# EAGLE design connector-2channel (EAGLE 6.1)
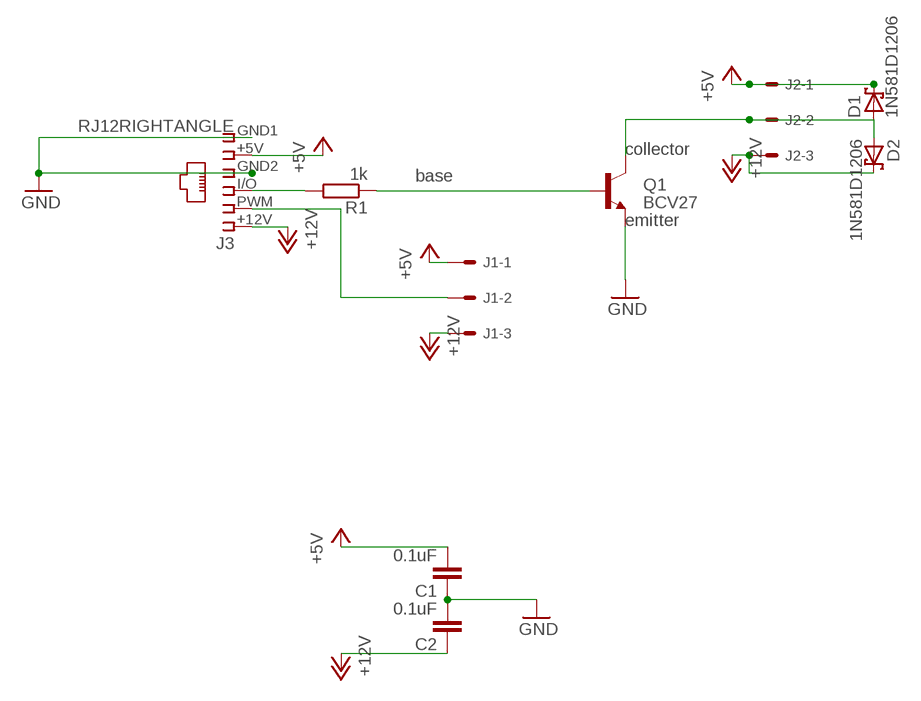
[diagram p0: schematic, sheet 1]

## Parts
C1  0.1uF  C-EUC1206  [C1206]
C2  0.1uF  C-EUC1206  [C1206]
D1  1N581D1206  [LED-1206]
D2  1N581D1206  [LED-1206]
J1  22-27-2031-03  [6410-03]
J2  22-27-2031-03  [6410-03]
J3  RJ12RIGHTANGLE  [RJ12-RIGHTANGLE]
Q1  BCV27  TRANSISTOR_NPNSOT23  [SOT23]
R1  1k  R-EU_M1206  [M1206]

## Nets
+5V: C1.2 D1.C J1.1 J2.1 J3.+5V
+12V: C2.1 D2.C J1.3 J2.3 J3.+12V
GND [power]: C1.1 C2.2 J3.GND1 J3.GND2 Q1.2(E)
N$1: Q1.1(B) R1.1
N$2: J3.I/O R1.2
N$3: J1.2 J3.PWM
N$4: D1.A D2.A J2.2 Q1.3(C)

## Notes on the sheet
- collector
- base
- emitter

## Library data of the parts
C1 C2 = resistor:C-EU: CAPACITOR, European symbol
D1 D2 = lpatiny:1N581*: 1.0A SCHOTTKY BARRIER RECTIFIER Source: http://www.diodes.com/datasheets/ds23001.pdf
J1 J2 = con-molex:22-?-03: CONNECTOR wire to board 2.54 mm (.1 inch) pitch header; OC_FARNELL: unknown; OC_NEWARK: unknown
J3 = lpatiny:RJ12: CORCOM Modular RJ Jacks No Shield Source: www.tycoelectronics.com .. ENG_DS_1654001_1099_RJ_L_0507.pdf
Q1 = SparkFun:TRANSISTOR_NPN: Transistor NPN BJT configuration in SOT23 package. MMBT2222 is the common NPN we use. Double check BCE configuration again layout.
R1 = resistor:R-EU_: RESISTOR, European symbol

## Net classes
0 default: width 0.457 mm
1 power: width 0.457 mm
2 highpower: width 0.457 mm
3 fine: width 0.305 mm

## Board
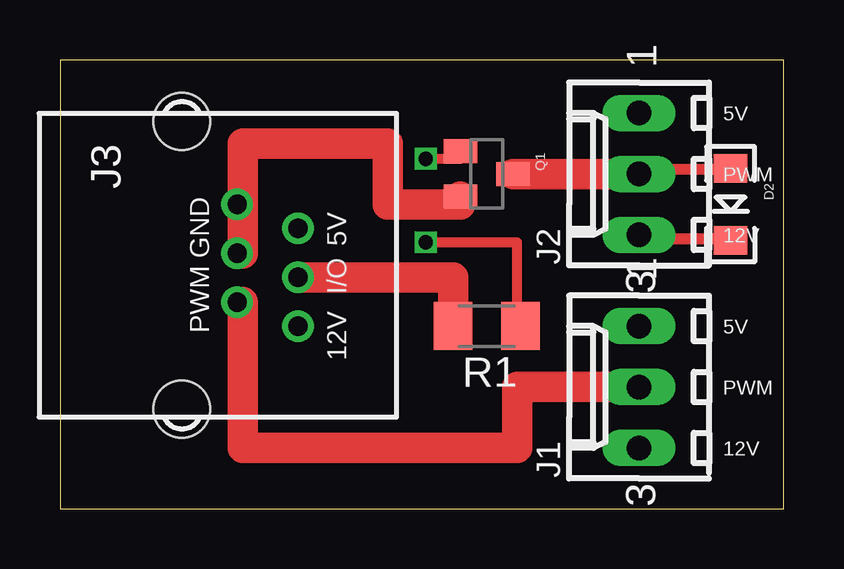
[diagram p1: board, top side]
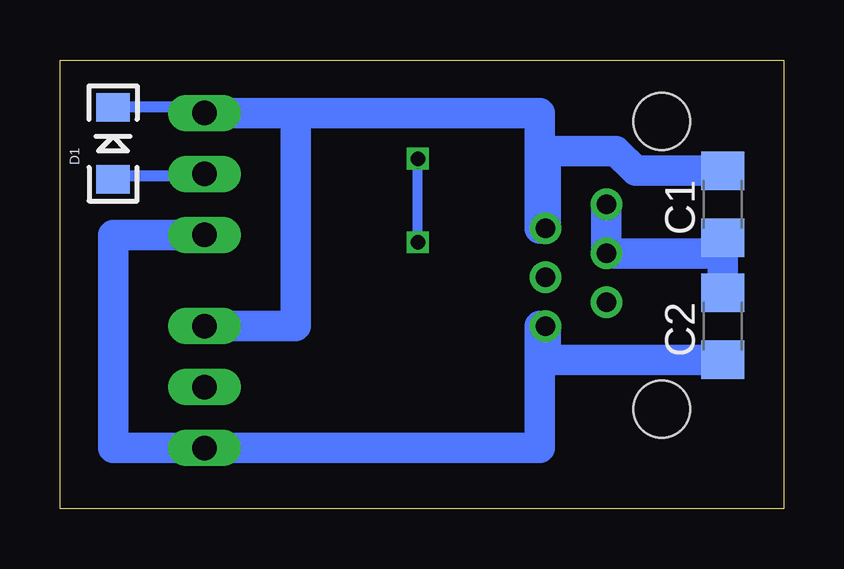
[diagram p2: board, bottom side, seen from below]

Size 30.15 x 18.72 mm. Coordinates in mm from the lower left corner, seen from the top.
Outline: 0,0 30.15,0 30.15,18.72 0,18.72 0,0
Copper layers (1*16): Top 0.035mm / dielectric 1.5mm / Bottom 0.035mm
Design rules: minimum track width 6mil, minimum drill 12mil, track to track 6mil, track to pad 6mil, pad to pad 6mil, via to via 6mil, smd to smd 0mil, copper to edge 10mil, drill to drill 10mil, minimum pad ring 10mil, minimum via ring 6mil, stop-mask expansion 2mil, vias tented up to drill 100mil, thermal gap 10mil

### Footprints (pad centres in the part's own frame; a part is rotated, then mirrored left to right if it is on the bottom)
C1206 = smd 1.6 x 1.8: 1 -1.4,0; 2 1.4,0
LED-1206 = smd 1.2 x 1.4: A -1.5,0; C 1.5,0
6410-03 = drill 1.016 long: 1 2.54,0; 2 0,0; 3 -2.54,0
RJ12-RIGHTANGLE = drill 0.8 pad 1.3: +5V -1.54,4.84; +12V 2.54,4.84; GND1 -2.54,2.3; GND2 -0.5,2.3; I/O 0.5,4.84; PWM 1.54,2.3 | hole 2.36: -6,0; 6,0
SOT23 = smd 1 x 1.4: 1 -0.95,-1.1; 2 0.95,-1.1; 3 0,1.1
M1206 = smd 1.6 x 2: 1 -1.4,0; 2 1.4,0

### Placement (x,y rotation side)
C1  2.54,12.7 90 bottom
C2  2.54,7.62 90 bottom
D1  27.94,15.24 90 bottom
D2  27.94,12.7 270 top
J1  24.13,5.08 90 top
J2  24.13,13.97 90 top
J3  5.08,10.16 270 top
Q1  17.78,13.97 270 top
R1  17.78,7.62 180 top

### Tracks (layer width: path | path; a pad name or v marks a point on that pad's centre or on a via)
+5V
  Bottom 0.457: D1.C 27.89,16.76 24.69,16.76 J2.1
  Bottom 1.27: C1.2 6.16,14.1 6.99,14.92 9.92,14.92 J3.+5V 10.16,11.7 10.16,16.51 J2.1 20.32,16.51 20.32,7.62 J1.1
+12V
  Top 0.457: D2.C 27.89,11.28 24.38,11.28 24.23,11.43 J2.3
  Bottom 1.27: C2.1 9.92,6.22 J3.+12V 10.16,7.62 10.16,2.54 J1.3 27.94,2.54 27.94,11.43 J2.3
GND
  Top 1.27: J3.GND2 7.62,10.66 7.62,15.24 13.65,15.24 13.65,12.7 16.68,12.7 Q1.2
  Bottom 1.27: J3.GND1 J3.GND2 2.54,10.66 C1.1 C2.2
N$1  (via drill 0.6)
  Top 0.406: R1.1 19.05,7.62 19.05,11.11 v15.24,11.11 | v15.24,14.61 16.68,14.61 Q1.1
  Bottom 0.406: v15.24,11.11 v15.24,14.61
N$2
  Top 1.27: J3.I/O 16.38,9.66 R1.2
N$3
  Top 1.27: J3.PWM 7.62,8.62 7.62,2.54 19.05,2.54 19.05,5.08 J1.2
N$4
  Top 0.457: D2.A 27.89,14.17 24.69,14.17 J2.2
  Top 1.27: J2.2 Q1.3
  Bottom 0.457: D1.A 27.89,13.87 24.23,13.87 J2.2

### Text on the board
tNames: 5V | PWM | 12V | 5V | PWM | 12V